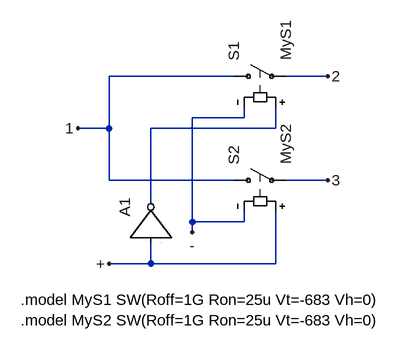
[diagram p0: schematic SPDT.asc]
SPDT.asc, the LTspice schematic file:
Version 4
SHEET 1 880 680
WIRE 224 80 32 80
WIRE 368 80 304 80
WIRE 240 144 240 128
WIRE 240 144 160 144
WIRE 32 160 32 80
WIRE 32 160 -16 160
WIRE 288 160 288 128
WIRE 288 160 96 160
WIRE 32 240 32 160
WIRE 224 240 32 240
WIRE 368 240 304 240
WIRE 96 272 96 160
WIRE 160 304 160 144
WIRE 240 304 240 288
WIRE 240 304 160 304
WIRE 160 320 160 304
WIRE 96 368 96 336
WIRE 96 368 32 368
WIRE 288 368 288 288
WIRE 288 368 96 368
FLAG 160 320 -
FLAG 32 368 +
FLAG -16 160 1
FLAG 368 240 3
FLAG 368 80 2
SYMBOL sw 208 80 R270
SYMATTR InstName S1
SYMATTR Value MyS1
SYMBOL sw 208 240 R270
SYMATTR InstName S2
SYMATTR Value MyS2
SYMBOL Digital\\inv 32 336 R270
SYMATTR InstName A1
TEXT -104 424 Left 2 !.model MyS1 SW(Roff=1G Ron=25u Vt=-683 Vh=0)\n.model MyS2 SW(Roff=1G Ron=25u Vt=-683 Vh=0)

The netlist it stands for:
* SPDT.asc
S1 1 2 N001 - MyS1
S2 1 3 + - MyS2
A1 + 0 0 0 0 N001 0 0 BUF
.model MyS1 SW(Roff=1G Ron=25u Vt=-683 Vh=0)
.model MyS2 SW(Roff=1G Ron=25u Vt=-683 Vh=0)
.backanno
.end